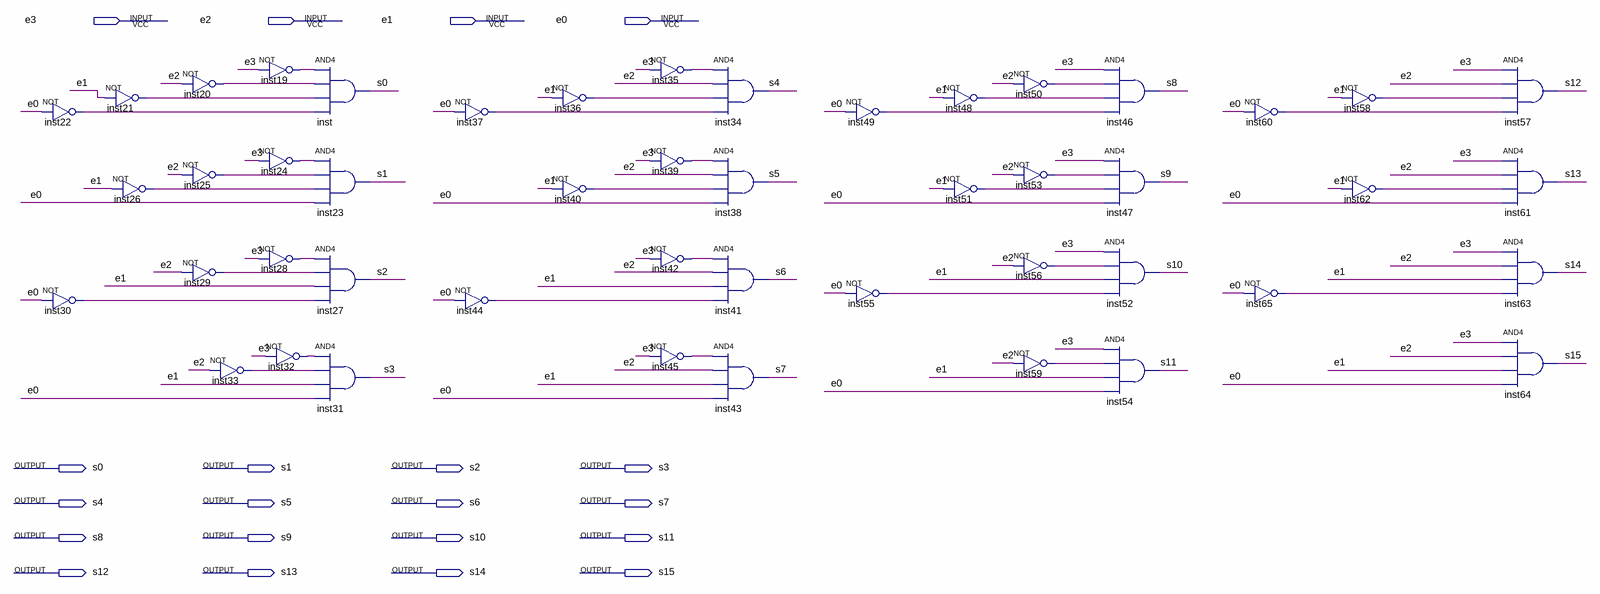
[diagram p0: schematic sheet]
// Quartus schematic abk_decod4x16.bdf as structural Verilog: 48 symbols, 20 pins
module abk_decod4x16 (
  input  e3,
  input  e2,
  input  e1,
  input  e0,
  output s0,
  output s1,
  output s2,
  output s3,
  output s4,
  output s5,
  output s6,
  output s7,
  output s8,
  output s9,
  output s10,
  output s11,
  output s12,
  output s13,
  output s14,
  output s15
);

  wire inst19_out, inst20_out, inst21_out, inst22_out, inst24_out, inst25_out, inst26_out, inst28_out,
       inst29_out, inst30_out, inst32_out, inst33_out, inst35_out, inst36_out, inst37_out, inst39_out,
       inst40_out, inst42_out, inst44_out, inst45_out, inst48_out, inst49_out, inst50_out, inst51_out,
       inst53_out, inst55_out, inst56_out, inst58_out, inst59_out, inst60_out, inst62_out, inst65_out;

  not inst22 (inst22_out, e0);
  not inst30 (inst30_out, e0);
  not inst21 (inst21_out, e1);
  not inst26 (inst26_out, e1);
  not inst20 (inst20_out, e2);
  not inst25 (inst25_out, e2);
  not inst29 (inst29_out, e2);
  not inst33 (inst33_out, e2);
  not inst19 (inst19_out, e3);
  not inst24 (inst24_out, e3);
  not inst28 (inst28_out, e3);
  not inst32 (inst32_out, e3);
  and inst (s0, inst19_out, inst20_out, inst21_out, inst22_out);
  and inst23 (s1, inst24_out, inst25_out, inst26_out, e0);
  and inst27 (s2, inst28_out, inst29_out, e1, inst30_out);
  and inst31 (s3, inst32_out, inst33_out, e1, e0);
  not inst37 (inst37_out, e0);
  not inst44 (inst44_out, e0);
  not inst36 (inst36_out, e1);
  not inst40 (inst40_out, e1);
  not inst35 (inst35_out, e3);
  not inst39 (inst39_out, e3);
  not inst42 (inst42_out, e3);
  not inst45 (inst45_out, e3);
  and inst34 (s4, inst35_out, e2, inst36_out, inst37_out);
  and inst38 (s5, inst39_out, e2, inst40_out, e0);
  and inst41 (s6, inst42_out, e2, e1, inst44_out);
  and inst43 (s7, inst45_out, e2, e1, e0);
  not inst49 (inst49_out, e0);
  not inst55 (inst55_out, e0);
  not inst48 (inst48_out, e1);
  not inst51 (inst51_out, e1);
  not inst50 (inst50_out, e2);
  not inst53 (inst53_out, e2);
  not inst56 (inst56_out, e2);
  not inst59 (inst59_out, e2);
  and inst46 (s8, e3, inst50_out, inst48_out, inst49_out);
  and inst47 (s9, e3, inst53_out, inst51_out, e0);
  and inst52 (s10, e3, inst56_out, e1, inst55_out);
  and inst54 (s11, e3, inst59_out, e1, e0);
  not inst60 (inst60_out, e0);
  not inst65 (inst65_out, e0);
  not inst58 (inst58_out, e1);
  not inst62 (inst62_out, e1);
  and inst57 (s12, e3, e2, inst58_out, inst60_out);
  and inst61 (s13, e3, e2, inst62_out, e0);
  and inst63 (s14, e3, e2, e1, inst65_out);
  and inst64 (s15, e3, e2, e1, e0);
endmodule
